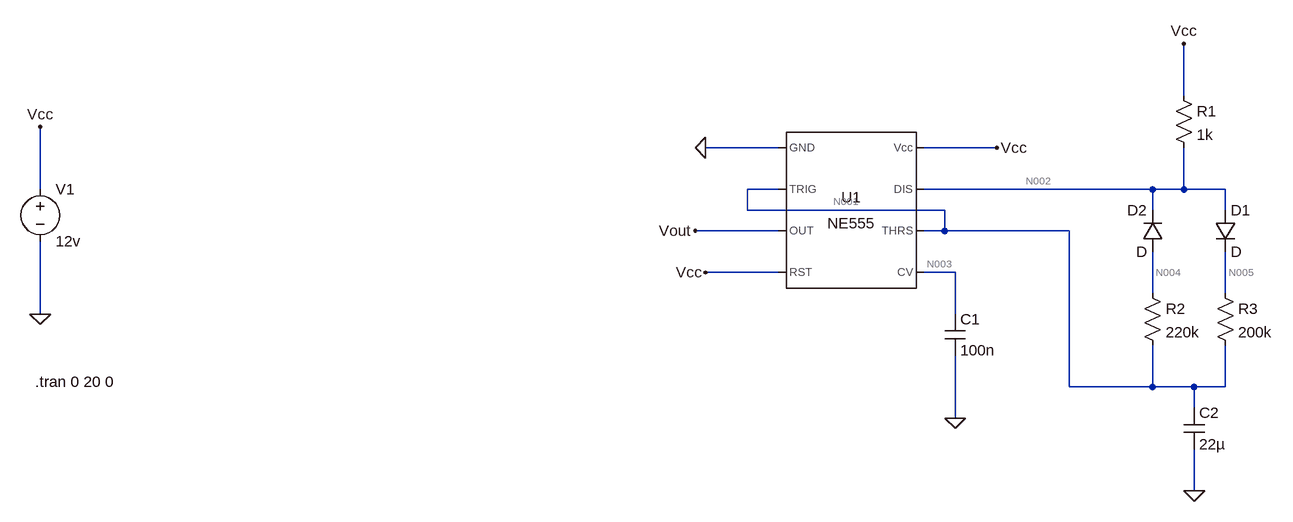
[diagram p0: schematic schematic.asc]
schematic.asc, the LTspice schematic file:
Version 4
SHEET 1 880 680
WIRE 688 0 688 -80
WIRE 64 80 -48 80
WIRE 400 80 288 80
WIRE -1072 144 -1072 48
WIRE 64 144 16 144
WIRE 640 144 288 144
WIRE 688 144 688 80
WIRE 688 144 640 144
WIRE 752 144 688 144
WIRE 16 176 16 144
WIRE 320 176 16 176
WIRE 640 176 640 144
WIRE 752 176 752 144
WIRE 64 208 -64 208
WIRE 320 208 320 176
WIRE 320 208 288 208
WIRE 512 208 320 208
WIRE 64 272 -48 272
WIRE 336 272 288 272
WIRE 640 304 640 240
WIRE 752 304 752 240
WIRE -1072 336 -1072 224
WIRE 336 336 336 272
WIRE 512 448 512 208
WIRE 640 448 640 384
WIRE 640 448 512 448
WIRE 704 448 640 448
WIRE 752 448 752 384
WIRE 752 448 704 448
WIRE 704 480 704 448
WIRE 336 496 336 400
WIRE 704 608 704 544
FLAG -1072 336 0
FLAG -1072 48 Vcc
FLAG -48 80 0
FLAG 400 80 Vcc
FLAG 336 496 0
FLAG -48 272 Vcc
FLAG -64 208 Vout
FLAG 688 -80 Vcc
FLAG 704 608 0
SYMBOL Misc\\NE555 176 176 R0
SYMATTR InstName U1
SYMBOL voltage -1072 128 R0
WINDOW 123 0 0 Left 0
WINDOW 39 0 0 Left 0
SYMATTR InstName V1
SYMATTR Value 12v
SYMBOL cap 320 336 R0
SYMATTR InstName C1
SYMATTR Value 100n
SYMBOL res 672 -16 R0
SYMATTR InstName R1
SYMATTR Value 1k
SYMBOL diode 736 176 R0
SYMATTR InstName D1
SYMBOL diode 656 240 R180
WINDOW 0 24 64 Left 2
WINDOW 3 24 0 Left 2
SYMATTR InstName D2
SYMBOL res 624 288 R0
SYMATTR InstName R2
SYMATTR Value 220k
SYMBOL res 736 288 R0
SYMATTR InstName R3
SYMATTR Value 200k
SYMBOL cap 688 480 R0
SYMATTR InstName C2
SYMATTR Value 22µ
TEXT -1080 440 Left 2 !.tran 0 20 0

The netlist it stands for:
* schematic.asc
XU1 0 N001 Vout Vcc N003 N001 N002 Vcc NE555  ; pins GND TRIG OUT RST CV THRS DIS Vcc
V1 Vcc 0 12v
C1 N003 0 100n
R1 Vcc N002 1k
D1 N002 N005 D
D2 N004 N002 D
R2 N004 N001 220k
R3 N005 N001 200k
C2 N001 0 22µ
.model D D
.lib standard.dio
.tran 0 20 0
.lib NE555.sub
.backanno
.end

* Results of the author's LTspice run, read from the files saved beside the schematic
* Operating Point, zero values left out:
*   V(n001) = 11.62 V
*   V(n003) = 8 V
*   V(vcc) = 12 V
*   V(n002) = 12 V
*   V(vout) = 12 V
*   V(n005) = 11.62 V
*   V(n004) = 11.62 V
*   I(D1) = 23.24 nA
*   I(R3) = 23.23 nA
*   I(R1) = 39.24 nA
*   I(V1) = -3.881 mA
*   Ix(u1:1) = -3.881 mA
*   Ix(u1:2) = 11.62 nA
*   Ix(u1:4) = 69.33 µA
*   Ix(u1:6) = 11.62 nA
*   Ix(u1:7) = 16.01 nA
*   Ix(u1:8) = 3.812 mA
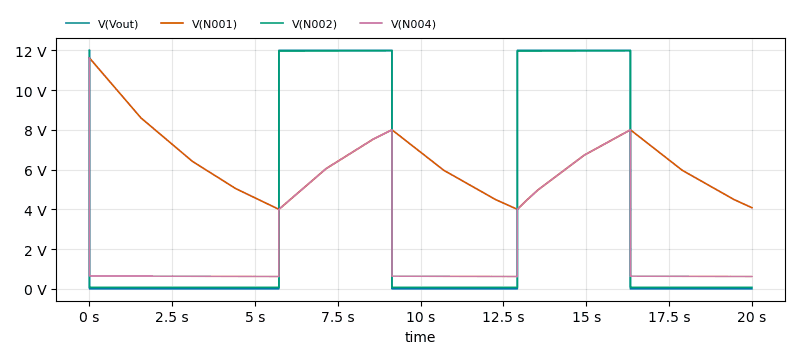
[diagram p1: Transient Analysis of schematic.asc, plotted from the saved traces]
* Transient Analysis, 1 run:
*   V(Vout): min 72 µV, max 12 V, average 4.097 V, rms 7.011 V, last 72 µV
*   V(N001): min 3.999 V, max 11.62 V, average 6.326 V, rms 6.568 V, last 4.083 V
*   V(N002): min 71.66 mV, max 12 V, average 4.135 V, rms 6.996 V, last 71.66 mV
*   V(N004): min 618.8 mV, max 11.62 V, average 2.538 V, rms 3.748 V, last 619.4 mV